# Altium schematic sheet Sheet1.SchDoc
size A1
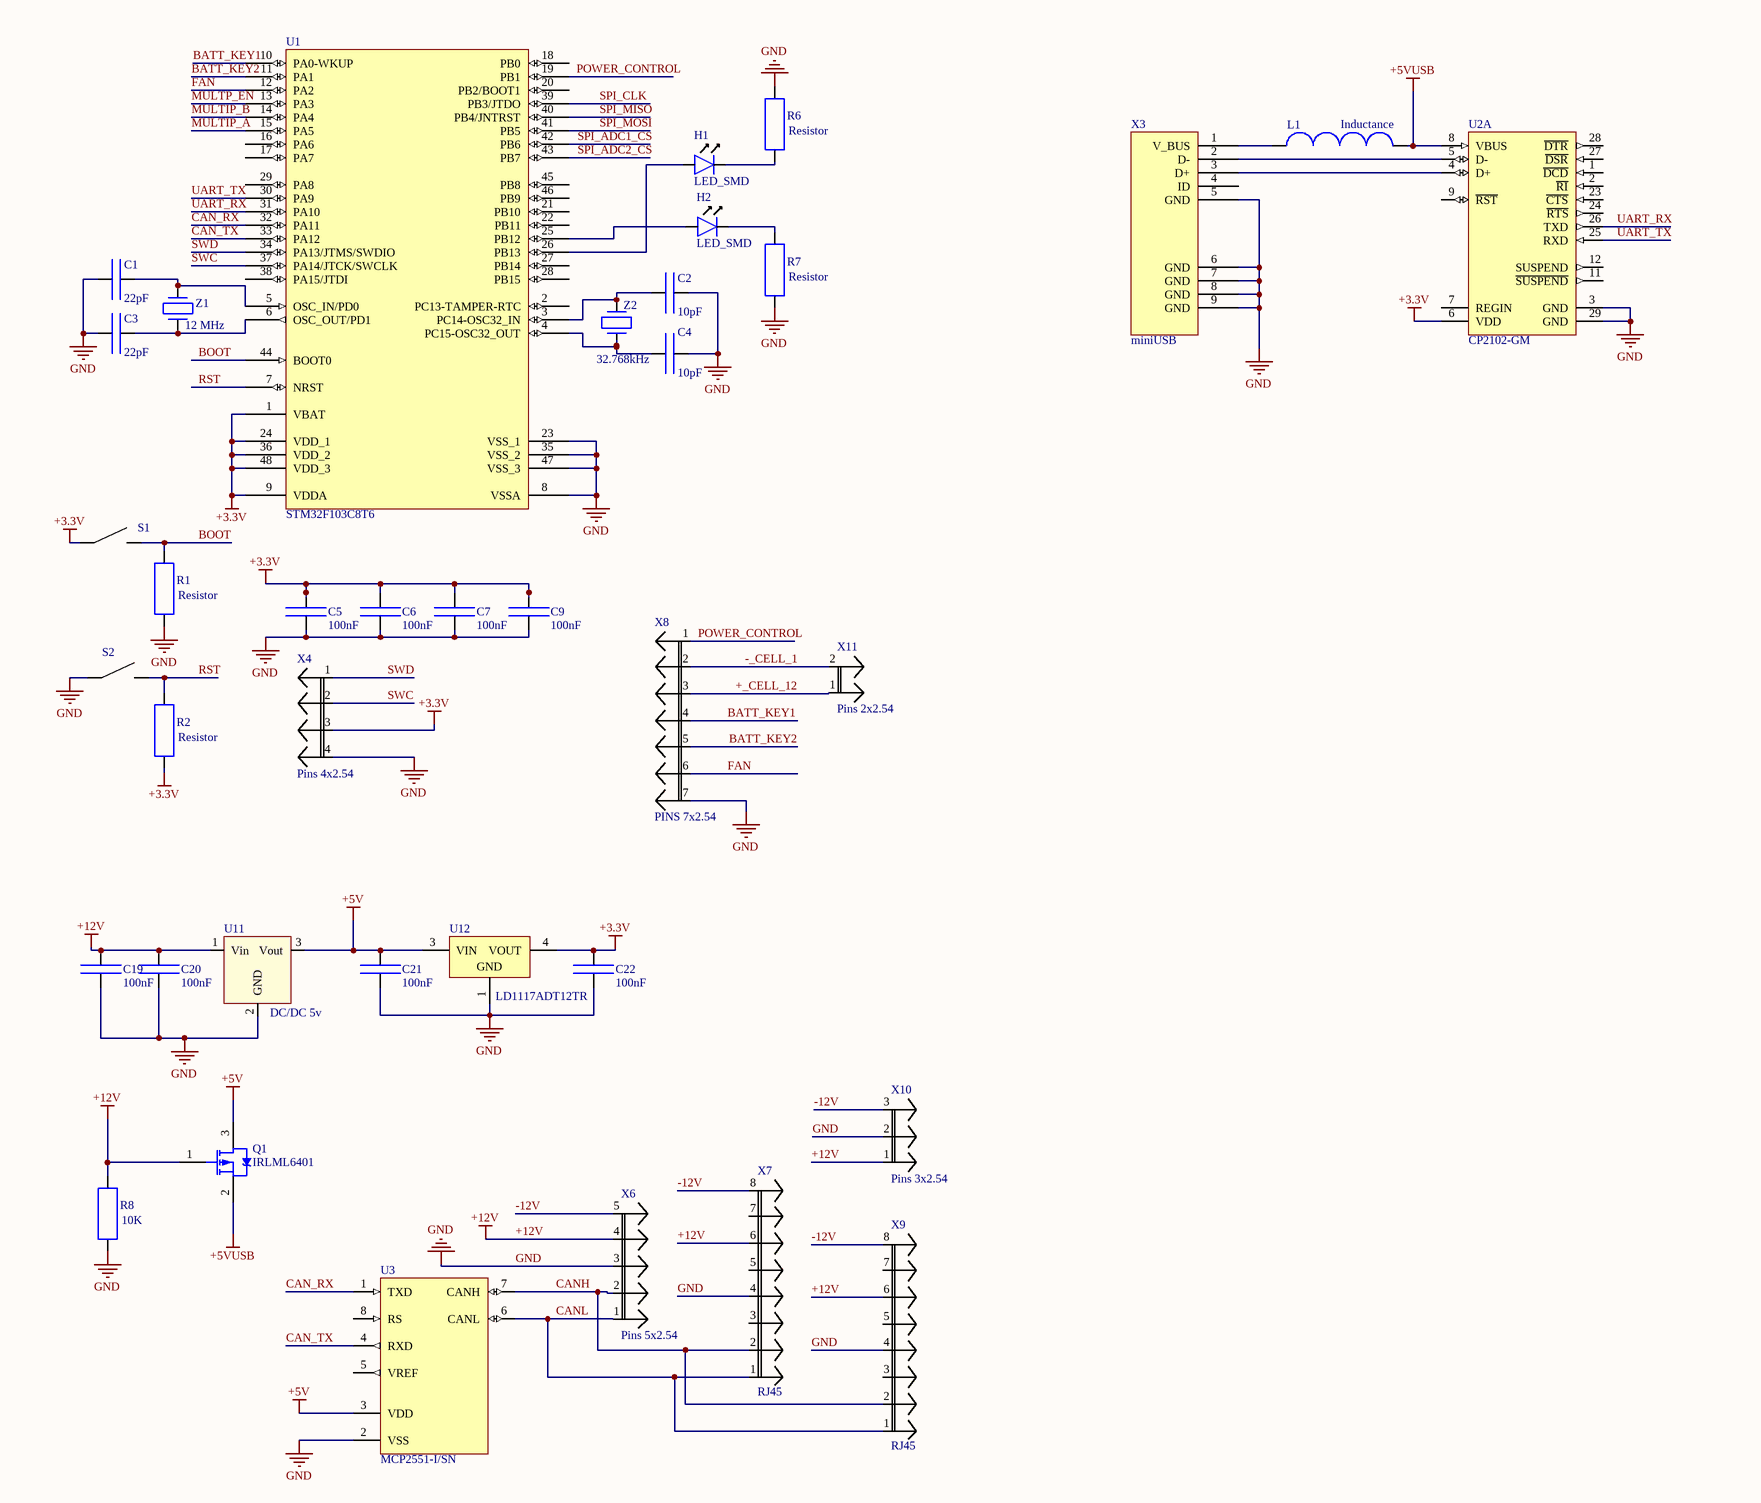
[diagram p0: Sheet1.SchDoc, top]
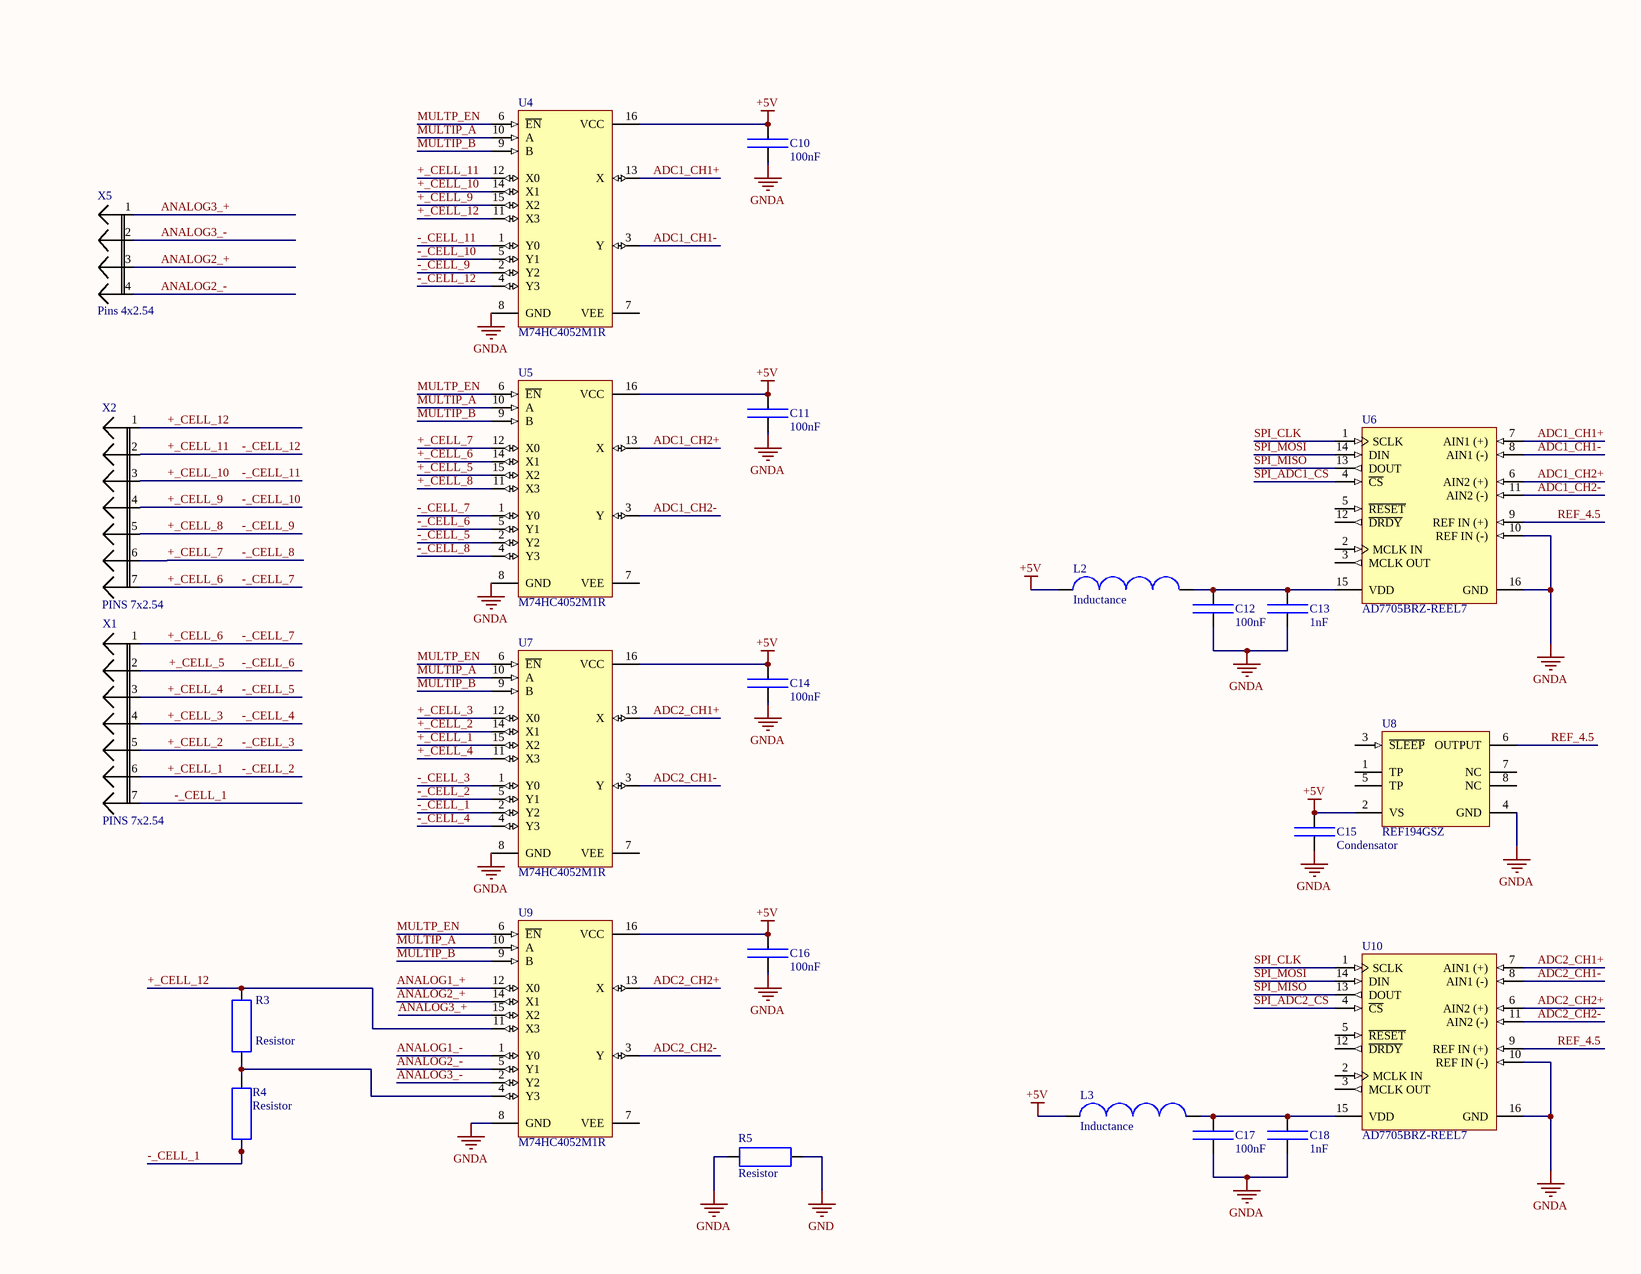
[diagram p1: Sheet1.SchDoc, bottom]

## Parts
C1  22pF  [C0805]
C2  10pF  [C0805]
C3  22pF  [C0805]
C4  10pF  [C0805]
C5  100nF  [C0805]
C6  100nF  [C0805]
C7  100nF  [C0805]
C9  100nF  [C0805]
C10  100nF  [C0805]
C11  100nF  [C0805]
C12  100nF  [C0805]
C13  1nF  [C0805]
C14  100nF  [C0805]
C15  Condensator  [C0805]
C16  100nF  [C0805]
C17  100nF  [C0805]
C18  1nF  [C0805]
C19  100nF  [C0805]
C20  100nF  [C0805]
C21  100nF  [C0805]
C22  100nF  [C0805]
H1  LED_SMD  [C0805]
H2  LED_SMD  [C0805]
L1  Inductance  [L0805]
L2  Inductance  [L0805]
L3  Inductance  [L0805]
Q1  IRLML6401  [sot-23]
R1  Resistor  [R0805]
R2  Resistor  [R0805]
R3  Resistor  [R0805]
R4  Resistor  [R0805]
R5  Resistor  [R0805]
R6  Resistor  [R0805]
R7  Resistor  [R0805]
R8  10K  [R0805]
S1  Tact_switch  [Tact_switch_smd]  (value not drawn)
S2  Tact_switch  [Tact_switch_smd]  (value not drawn)
U1  STM32F103C8T6  [LQFP48_N]
U2  CP2102-GM  [SLAB-QFN-28-3125x3125TP_N]  (part A of 2)
U3  MCP2551-I/SN  [SOIC-SN8_N]
U4  M74HC4052M1R  [SO16_N]
U5  M74HC4052M1R  [SO16_N]
U6  AD7705BRZ-REEL7  [RW-16_N]
U7  M74HC4052M1R  [SO16_N]
U8  REF194GSZ  [ADI-R-8_N]
U9  M74HC4052M1R  [SO16_N]
U10  AD7705BRZ-REEL7  [RW-16_N]
U11  DC/DC 5v  [DC/DC R-78E]
U12  LD1117ADT12TR  [TO-252_N]
X1  PINS 7x2.54  [PINS 7X2.54]
X2  PINS 7x2.54  [PINS 7X2.54]
X3  miniUSB  [miniUSB]
X4  Pins 4x2.54  [Pins 4x2.54]
X5  Pins 4x2.54  [Pins 4x2.54]
X6  Pins 5x2.54  [Pins 5x2.54]
X7  RJ45  [RJ45]
X8  PINS 7x2.54  [PINS 7X2.54]
X9  RJ45  [RJ45]
X10  Pins 3x2.54  [Pins 3x2.54]
X11  Pins 2x2.54  [Pins 2x2.54]
Z1  12 MHz  [kx 13 12MHz]
Z2  32.768kHz  [Geyer KX - 327S 32.768kHz]

## Nets
+3.3V: C5.2 C6.2 C7.2 C9.2 C22.2 R2.1 S1.1 U1.1(VBAT) U1.9(VDDA) U1.24(VDD_1) U1.36(VDD_2) U1.48(VDD_3) U2.6(VDD) U12.4(VOUT) X4.3
+5V: C10.1 C11.1 C14.1 C15.1 C16.1 C21.2 L2.1 L3.1 Q1.3(D) U3.3(VDD) U4.16(VCC) U5.16(VCC) U7.16(VCC) U8.2(VS) U9.16(VCC) U11.3(Vout) U12.3(VIN)
+5VUSB: L1.2 Q1.2(S) U2.8(VBUS)
+12V: C19.2 C20.2 Q1.1(G) R8.2 U11.1(Vin) X6.4 X7.6 X9.6 X10.1
GND: C1.1 C2.1 C3.1 C4.1 C5.1 C6.1 C7.1 C9.1 C19.1 C20.1 C21.1 C22.1 R1.1 R5.1 R6.2 R7.1 R8.1 S2.1 U1.8(VSSA) U1.23(VSS_1) U1.35(VSS_2) U1.47(VSS_3) U2.3(GND) U2.29(GND) U3.2(VSS) U11.2(GND) U12.1(GND) X3.5(GND) X3.6(GND) X3.7(GND) X3.8(GND) X3.9(GND) X4.4 X6.3 X7.4 X8.7 X9.4 X10.2
GNDA: C10.2 C11.2 C12.2 C13.2 C14.2 C15.2 C16.2 C17.2 C18.2 R5.2 U4.8(GND) U5.8(GND) U6.10(REF_IN_(-)) U6.16(GND) U7.8(GND) U8.4(GND) U9.8(GND) U10.10(REF_IN_(-)) U10.16(GND)
+_CELL_1: U7.5(Y1) U7.15(X2) X1.6  [also labelled -_CELL_2]
+_CELL_2: U7.1(Y0) U7.14(X1) X1.5  [also labelled -_CELL_3]
+_CELL_3: U7.4(Y3) U7.12(X0) X1.4  [also labelled -_CELL_4]
+_CELL_4: U5.2(Y2) U7.11(X3) X1.3  [also labelled -_CELL_5]
+_CELL_5: U5.5(Y1) U5.15(X2) X1.2  [also labelled -_CELL_6]
+_CELL_6: U5.1(Y0) U5.14(X1) X1.1 X2.7  [also labelled -_CELL_7]
+_CELL_7: U5.4(Y3) U5.12(X0) X2.6  [also labelled -_CELL_8]
+_CELL_8: U4.2(Y2) U5.11(X3) X2.5  [also labelled -_CELL_9]
+_CELL_9: U4.5(Y1) U4.15(X2) X2.4  [also labelled -_CELL_10]
+_CELL_10: U4.1(Y0) U4.14(X1) X2.3  [also labelled -_CELL_11]
+_CELL_11: U4.4(Y3) U4.12(X0) X2.2  [also labelled -_CELL_12]
+_CELL_12: R3.2 U4.11(X3) U9.11(X3) X2.1 X8.3 X11.1
-12V: X6.5 X7.8 X9.8 X10.3
-_CELL_1: R4.1 U7.2(Y2) X1.7 X8.2 X11.2
ADC1_CH1+: U4.13(X) U6.7(AIN1_(+))
ADC1_CH1-: U4.3(Y) U6.8(AIN1_(-))
ADC1_CH2+: U5.13(X) U6.6(AIN2_(+))
ADC1_CH2-: U5.3(Y) U6.11(AIN2_(-))
ADC2_CH1+: U7.13(X) U10.7(AIN1_(+))
ADC2_CH1-: U7.3(Y) U10.8(AIN1_(-))
ADC2_CH2+: U9.13(X) U10.6(AIN2_(+))
ADC2_CH2-: U9.3(Y) U10.11(AIN2_(-))
ANALOG1_+: U9.12(X0)
ANALOG1_-: U9.1(Y0)
ANALOG2_+: U9.14(X1) X5.3
ANALOG2_-: U9.5(Y1) X5.4
ANALOG3_+: U9.15(X2) X5.1
ANALOG3_-: U9.2(Y2) X5.2
BATT_KEY1: U1.10(PA0-WKUP) X8.4
BATT_KEY2: U1.11(PA1) X8.5
BOOT: R1.2 S1.2 U1.44(BOOT0)
CAN_RX: U1.32(PA11) U3.1(TXD)
CAN_TX: U1.33(PA12) U3.4(RXD)
CANH: U3.7(CANH) X6.2 X7.2 X9.2
CANL: U3.6(CANL) X6.1 X7.1 X9.1
FAN: U1.12(PA2) X8.6
MULTIP_A: U1.15(PA5) U4.10(A) U5.10(A) U7.10(A) U9.10(A)
MULTIP_B: U1.14(PA4) U4.9(B) U5.9(B) U7.9(B) U9.9(B)
MULTP_EN: U1.13(PA3) U4.6(~{EN}) U5.6(~{EN}) U7.6(~{EN}) U9.6(~{EN})
POWER_CONTROL: U1.19(PB1) X8.1
REF_4.5: U6.9(REF_IN_(+)) U8.6(OUTPUT) U10.9(REF_IN_(+))
RST: R2.2 S2.2 U1.7(NRST)
SPI_ADC1_CS: U1.42(PB6) U6.4(~{CS})
SPI_ADC2_CS: U1.43(PB7) U10.4(~{CS})
SPI_CLK: U1.39(PB3/JTDO) U6.1(SCLK) U10.1(SCLK)
SPI_MISO: U1.40(PB4/JNTRST) U6.13(DOUT) U10.13(DOUT)
SPI_MOSI: U1.41(PB5) U6.14(DIN) U10.14(DIN)
SWC: U1.37(PA14/JTCK/SWCLK) X4.2
SWD: U1.34(PA13/JTMS/SWDIO) X4.1
UART_RX: U1.31(PA10) U2.26(TXD)
UART_TX: U1.30(PA9) U2.25(RXD)
NetC1_2: C1.2 U1.5(OSC_IN/PD0) Z1.1
NetC2_2: C2.2 U1.3(PC14-OSC32_IN) Z2.1
NetC3_2: C3.2 U1.6(OSC_OUT/PD1) Z1.3
NetC4_2: C4.2 U1.4(PC15-OSC32_OUT) Z2.2
NetC12_1: C12.1 C13.1 L2.2 U6.15(VDD)
NetC17_1: C17.1 C18.1 L3.2 U10.15(VDD)
NetH1_1: H1.1 U1.26(PB13)
NetH1_2: H1.2 R6.1
NetH2_1: H2.1 U1.25(PB12)
NetH2_2: H2.2 R7.2
NetL1_1: L1.1 X3.1(V_BUS)
NetR3_1: R3.1 R4.2 U9.4(Y3)
NetU2_4: U2.4(D+) X3.3(D+)
NetU2_5: U2.5(D-) X3.2(D-)

Not connected (* = marked no-connect by the designer): U1 2(PC13-TAMPER-RTC) 16(PA6) 17(PA7) 18(PB0) 20(PB2/BOOT1) 21(PB10) 22(PB11) 27(PB14) 28(PB15) 29(PA8) 38(PA15/JTDI) 45(PB8) 46(PB9); U2 1(~{DCD}) 2(~{RI}) 7(REGIN) 9(~{RST}) 11(~{SUSPEND}) 12(SUSPEND) 23(~{CTS}) 24(~{RTS}) 27(~{DSR}) 28(~{DTR}); U3 5(VREF) 8(RS); U4 7(VEE); U5 7(VEE); U6 2(MCLK_IN) 3(MCLK_OUT) 5(~{RESET}) 12(~{DRDY}); U7 7(VEE); U8 1(TP) 3(~{SLEEP}) 5(TP) 7(NC) 8(NC); U9 7(VEE); U10 2(MCLK_IN) 3(MCLK_OUT) 5(~{RESET}) 12(~{DRDY}); X3 4(ID); X7 3 5 7; X9 3 5 7

## Library data of the parts
C1-C7 C9-C14 C16-C22 = Condensator
R8 = Resistor
U1 = STM32F103C8T6: STM32 ARM-based 32-bit MCU with 64 Kbytes Flash, 48-pin LQFP, Industrial Temperature; Published: 30-May-2008; DatasheetVersion: rev6, Mar-2008; PackageVersion: Mar-2008; PackageReference: LQFP48; Publisher: Altium Limited; PackageDescription: 48-Pin Low-Profile Quad Flat Pack, 7 x 7 mm Body, 0.5 mm Pitch (LQFP48); ComponentLink1Description: Manufacturer Link; ComponentLink1URL: www.st.com/stm32; ComponentLink2Description: Datasheet; ComponentLink2URL: http://www.st.com/stonline/products/literature/ds/13587.pdf
U2 = CP2102-GM: Single-Chip USB to UART Bridge, 1024 Bytes EEPROM, -40 to 85 degC, 28-pin QFN, Tube; Manufacturer: Silicon Labs; Internal Oscillator: TRUE; Sub-Family: USB Bridges; DatasheetVersion: Rev. 1.5; PackageReference: QFN-28; PackageDescription: 28-Pin Quad-Flat No-Leads Package, Body 5 x 5 mm, Pitch 0.5 mm; Supplier 1: Digi-Key; Supplier Part Number 1: 336-1160-5-ND; Supplier 2: Farnell; Supplier Part Number 2: 9282130; Supplier 3: Newark; Supplier Part Number 3: 30K5635; Supplier 4: Mouser; Supplier Part Number 4: 634-CP2102-GM; EEPROM: 1024 Bytes; Mounting Technology: Surface Mount; Code_JEDEC: MO-220; Code_IPC: J-STD-020C; PartNumber: CP2102-GM; ComponentLink1Description: Manufacturer URL; ComponentLink1URL: http://www.silabs.com/; ComponentLink2Description: Datasheet; ComponentLink2URL: http://www.silabs.com/Support%20Documents/TechnicalDocs/CP2102-9.pdf; ComponentLink3Description: Package Specification; ComponentLink3URL: http://www.silabs.com/Support%20Documents/TechnicalDocs/C8051T61x.pdf
U3 = MCP2551-I/SN: High-Speed CAN Transceiver, 8-Pin SOIC, Industrial Temperature; Published: 29-Jan-2009; DatasheetVersion: revE, Jan-2007; PackageVersion: revBB, Aug-2009; PackageReference: SOIC-SN8; Publisher: Altium Limited; PackageDescription: 8-Lead Plastic Small Outline (SN) - Narrow, 3.90mm Body [SOIC]; Supplier 1: Digi-Key; Supplier Part Number 1: MCP2551-I/SN-ND; Supplier 2: Farnell; Supplier Part Number 2: 9758569; Code_JEDEC: MS-012; Code_IPC: SOIC127P600-8; ComponentLink1Description: Datasheet; ComponentLink1URL: http://ww1.microchip.com/downloads/en/DeviceDoc/21667E.pdf; ComponentLink2Description: Packaging Specification; ComponentLink2URL: http://www.microchip.com/stellent/groups/techpub_sg/documents/packagingspec/en012702.pdf; ComponentLink3Description: Microchip.com Home; ComponentLink3URL: http://www.microchip.com/
U4 U5 U7 U9 = M74HC4052M1R: Analog Multiplexer/Demultiplexer Dual 4-Channel; Published: 8-Jun-2000; LatestRevisionDate: 13-Apr-2006; LatestRevisionNote: IPC-7351 Footprint Added.; DatasheetVersion: Oct-1993; PackageVersion: May-1998; PackageReference: SO16; Publisher: Altium Limited; PackageDescription: 16-Pin Small Outline Integrated Circuit 1.27 mm Pitch; Code_IPC: SOIC127P600-16; ComponentLink1Description: Manufacturer Link; ComponentLink1URL: http://www.st.com/; ComponentLink2Description: Datasheet; ComponentLink2URL: http://www.st.com/stonline/products/literature/ds/7730/m74hc4052.pdf
U6 U10 = AD7705BRZ-REEL7: Dual 16-Bit Sigma-Delta Analog-to-Digital Converter with Serial, SPI Interface, 1 mW, 3 V / 5 V, 500SPS, -40 to +85 degC, RW-16, Pb-Free, Reel; Generic Part Number: AD7705; Manufacturer: Analog Devices; Resolution (Bits): 16; Channels: 2; Throughput Rate (SPS): 500; Interface: Ser, SPI; DatasheetVersion: Rev.C; PackageVersion: 032707-B; PackageReference: RW-16; PackageDescription: 16-Lead Standard Small Outline Package [SOIC_W]; Supplier 1: Digi-Key; Supplier Part Number 1: AD7705BRZ-REEL7TR-ND; Supplier 2: Digi-Key; Supplier Part Number 2: AD7705BRZ-REEL7CT-ND; Supplier 3: Digi-Key; Supplier Part Number 3: AD7705BRZ-REEL7DKR-ND; Supplier 4: Newark; Supplier Part Number 4: 59K5284; Supplier 5: Mouser; Supplier Part Number 5: 584-AD7705BRZ-R7; RoHS: Y; Packing: Reel; Mounting Technology: Surface Mount; Code_JEDEC: MS-013-AA; Code_IPC: SOIC127P1030-16; PartNumber: AD7705BRZ-REEL7; ComponentLink1Description: Manufacturer URL; ComponentLink1URL: http://www.analog.com/en/index.html; ComponentLink2Description: Datasheet; ComponentLink2URL: http://www.analog.com/static/imported-files/data_sheets/AD7705_7706.pdf; ComponentLink3Description: Package Specification; ComponentLink3URL: http://www.analog.com/static/imported-files/packages/PKG_PDF/SOIC_WIDE%20%28RW%29/RW_16.pdf; ComponentLink4Description: Product URL; ComponentLink4URL: http://www.analog.com/en/analog-to-digital-converters/ad-converters/ad7705/products/product.html
U8 = REF194GSZ: Precision Micropower, Low Dropout Voltage Reference, 4.5 V Output, 4.6 to 15 V Supply, Industrial, 8-pin SOIC (R-8), Tube; Manufacturer: Analog Devices; Ref Out TC (ppm/C): 10; Vout: 4.5V; DatasheetVersion: Rev. L; PackageVersion: 060506-A, 06/2006; PackageReference: R-8; PackageDescription: 8-Pin Standard Small Outline Package, Body 4.9 x 3.9 mm, Pitch 1.27 mm; Supplier 1: Digi-Key; Supplier Part Number 1: REF194GSZ-ND; Supplier 2: Farnell; Supplier Part Number 2: 2305785; Supplier 3: Newark; Supplier Part Number 3: 59K9042; Supplier 4: Mouser; Supplier Part Number 4: 584-REF194GSZ; Packing: Tube; Operating Temp Range: -40 to 85 degC; Mounting Technology: Surface Mount; Code_JEDEC: MS-012-AA; PartNumber: REF194GSZ; ComponentLink1Description: Manufacturer URL; ComponentLink1URL: http://www.analog.com/en/index.html; ComponentLink2Description: Datasheet; ComponentLink2URL: http://www.analog.com/static/imported-files/data_sheets/REF19xSeries.pdf; ComponentLink3Description: Package Specification; ComponentLink3URL: http://www.analog.com/static/imported-files/packages/PKG_PDF/SOIC_Narrow%20(R)/R_8.pdf; ComponentLink4Description: URL Link1; ComponentLink4URL: Product URL:http://www.analog.com/en/special-linear-functions/voltage-references/ref194/products/product.html
U11 = DC/DC R-78E
U12 = LD1117ADT12TR: 1A, Low Drop Positive Voltage Regulator, 1.2V, 3-Pin DPAK, Tape and Reel; DatasheetVersion: Dec-2011; PackageVersion: 2011; PackageReference: TO-252; PackageDescription: 3-Pin Transistor Outline Package 2.28 mm Pitch, 9.7 mm Lead Span (DPAK); PartNumber: LD1117ADT12TR; ComponentLink1Description: Manufacturer URL; ComponentLink1URL: http://www.st.com; ComponentLink2Description: Datasheet; ComponentLink2URL: http://www.st.com/internet/com/TECHNICAL_RESOURCES/TECHNICAL_LITERATURE/DATASHEET/CD00002116.pdf
Z1 = KX 13 Geyer
Z2 = Crystal Oscillator